# EAGLE design Intervalometer (EAGLE 5.02)
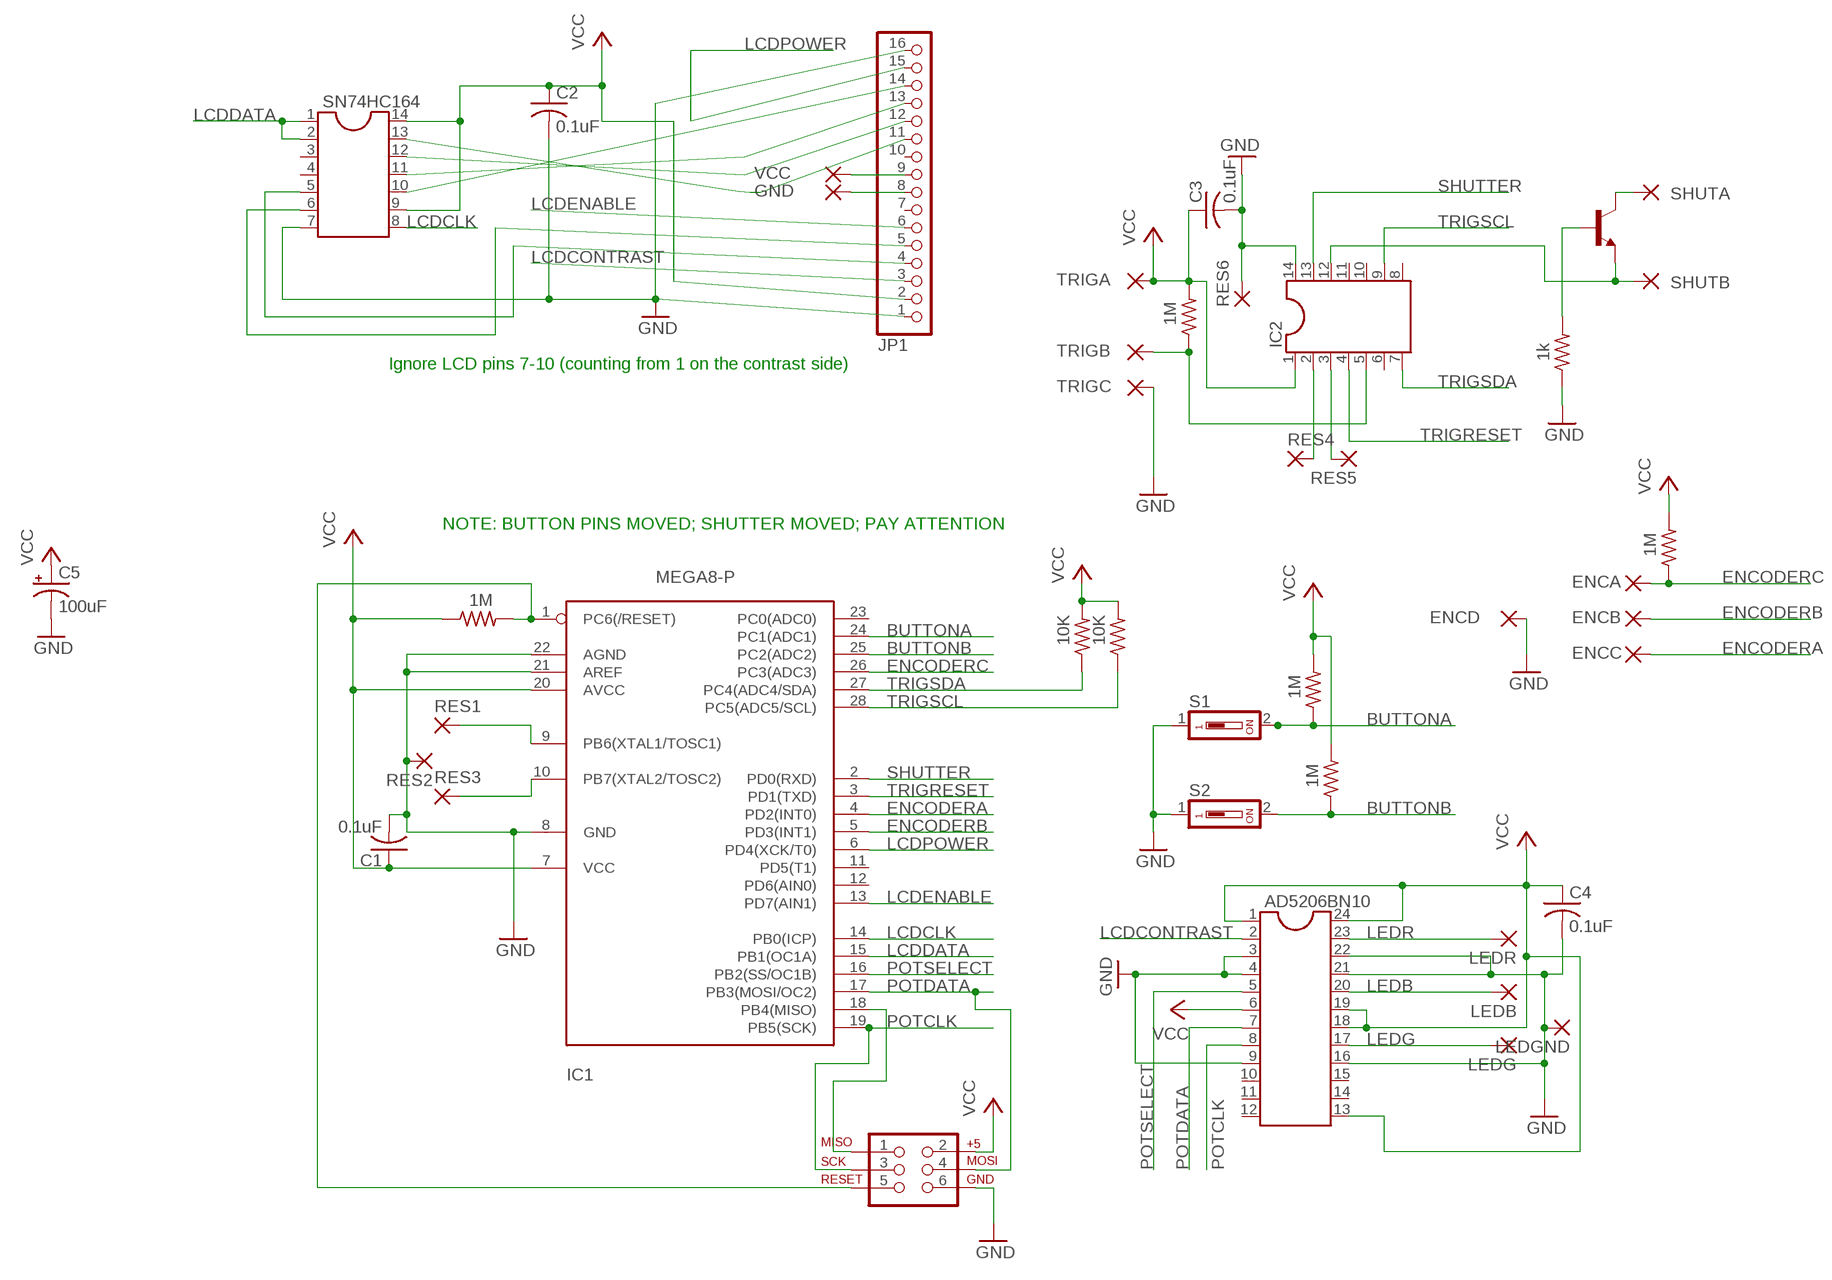
[diagram p0: schematic, sheet 1]

## Parts
AD5206BN10  DIL24-3  [DIL24-3]
C1  0.1uF  C-US025-025X050  [C025-025X050]
C2  0.1uF  C-US025-025X050  [C025-025X050]
C3  0.1uF  C-US025-025X050  [C025-025X050]
C4  0.1uF  C-US025-025X050  [C025-025X050]
C5  100uF  CPOL-USE2-5  [E2-5]
ENCA  1,6/0,9  [1,6/0,9]
ENCB  1,6/0,9  [1,6/0,9]
ENCC  1,6/0,9  [1,6/0,9]
ENCD  1,6/0,9  [1,6/0,9]
GND  1,6/0,9  [1,6/0,9]
IC1  MEGA8-P  [DIL28-3]
IC2  DIL14S  [SOCKET-14]
JP1  PINHD-1X16  [1X16]
LEDB  1,6/0,9  [1,6/0,9]
LEDG  1,6/0,9  [1,6/0,9]
LEDGND  1,6/0,9  [1,6/0,9]
LEDR  1,6/0,9  [1,6/0,9]
Q3  -NPN-TO92-EBC  [TO92-EBC]
R1  1M  R-US_0204/7  [0204/7]
R2  1k  R-US_0204/7  [0204/7]
R3  10K  R-US_0204/7  [0204/7]
R4  1M  R-US_0204/7  [0204/7]
R6  10K  R-US_0204/7  [0204/7]
R7  1M  R-US_0204/7  [0204/7]
R8  1M  R-US_0204/7  [0204/7]
R9  1M  R-US_0204/7  [0204/7]
RES1  1,6/0,9  [1,6/0,9]
RES2  1,6/0,9  [1,6/0,9]
RES3  1,6/0,9  [1,6/0,9]
RES4  1,6/0,9  [1,6/0,9]
RES5  1,6/0,9  [1,6/0,9]
RES6  1,6/0,9  [1,6/0,9]
S1  SD4-01  [SD4-01]
S2  SD4-01  [SD4-01]
SHUTA  1,6/0,9  [1,6/0,9]
SHUTB  1,6/0,9  [1,6/0,9]
SN74HC164  DIL14  [DIL14]
TRIGA  1,6/0,9  [1,6/0,9]
TRIGB  1,6/0,9  [1,6/0,9]
TRIGC  1,6/0,9  [1,6/0,9]
U$1  AVR_SPI_PRG_6PTH  [2X3]
VCC  1,6/0,9  [1,6/0,9]

## Nets
ASDF [adsf]: IC2.12 Q3.E SHUTB.1(P)
BUTTONA: IC1.24(PC1(ADC1)) R7.1 S1.2
BUTTONB: IC1.25(PC2(ADC2)) R8.1 S2.2
ENCODERA: ENCC.1(P) IC1.4(PD2(INT0))
ENCODERB: ENCB.1(P) IC1.5(PD3(INT1))
ENCODERC: ENCA.1(P) IC1.26(PC3(ADC3)) R4.1
GND [adsf]: AD5206BN10.3 AD5206BN10.4 AD5206BN10.9 AD5206BN10.16 AD5206BN10.21 AD5206BN10.22 C1.2 C2.2 C3.2 C4.2 C5.- ENCD.1(P) GND.1(P) IC1.8(GND) IC1.21(AREF) IC1.22(AGND) IC2.14 JP1.1 JP1.8 JP1.16 LEDGND.1(P) R2.1 RES2.1(P) RES6.1(P) S1.1 S2.1 SN74HC164.7 TRIGC.1(P) U$1.6
LCDCLK: IC1.14(PB0(ICP)) SN74HC164.8
LCDCONTRAST: AD5206BN10.2 JP1.3
LCDDATA: IC1.15(PB1(OC1A)) SN74HC164.1 SN74HC164.2
LCDENABLE: IC1.13(PD7(AIN1)) JP1.6
LCDPOWER: IC1.6(PD4(XCK/T0)) JP1.15
LEDB: AD5206BN10.20 LEDB.1(P)
LEDG: AD5206BN10.17 LEDG.1(P)
LEDR: AD5206BN10.23 LEDR.1(P)
N$1: IC1.9(PB6(XTAL1/TOSC1)) RES1.1(P)
N$2: IC1.10(PB7(XTAL2/TOSC2)) RES3.1(P)
N$3: IC1.1(PC6(/RESET)) R1.2 U$1.5
N$5: Q3.B R2.2
N$6 [adsf]: Q3.C SHUTA.1(P)
N$7: JP1.11 SN74HC164.13
N$8: JP1.12 SN74HC164.12
N$10: IC2.2 RES4.1(P)
N$11: IC2.5 R9.1 TRIGB.1(P)
N$12: JP1.4 SN74HC164.5
N$13: JP1.5 SN74HC164.6
N$14: IC2.3 RES5.1(P)
N$15: JP1.13 SN74HC164.11
N$16: JP1.14 SN74HC164.10
N$17: IC1.18(PB4(MISO)) U$1.1
POTCLK: AD5206BN10.8 IC1.19(PB5(SCK)) U$1.3
POTDATA: AD5206BN10.7 IC1.17(PB3(MOSI/OC2)) U$1.4
POTSELECT: AD5206BN10.5 IC1.16(PB2(SS/OC1B))
SHUTTER: IC1.2(PD0(RXD)) IC2.13
TRIGRESET: IC1.3(PD1(TXD)) IC2.4
TRIGSCL: IC1.28(PC5(ADC5/SCL)) IC2.9 R6.1
TRIGSDA: IC1.27(PC4(ADC4/SDA)) IC2.7 R3.1
VCC [adsf]: AD5206BN10.1 AD5206BN10.6 AD5206BN10.13 AD5206BN10.18 AD5206BN10.19 AD5206BN10.24 C1.1 C2.1 C3.1 C4.1 C5.+ IC1.7(VCC) IC1.20(AVCC) IC2.1 JP1.2 JP1.9 R1.1 R3.2 R4.2 R6.2 R7.2 R8.2 R9.2 SN74HC164.9 SN74HC164.14 TRIGA.1(P) U$1.2 VCC.1(P)
Unconnected: AD5206BN10.10 AD5206BN10.11 AD5206BN10.12 AD5206BN10.14 AD5206BN10.15 IC1.11(PD5(T1)) IC1.12(PD6(AIN0)) IC1.23(PC0(ADC0)) IC2.6 IC2.8 IC2.10 IC2.11 JP1.7 JP1.10 SN74HC164.3 SN74HC164.4

## Notes on the sheet
- Ignore LCD pins 7-10 (counting from 1 on the contrast side)
- NOTE: BUTTON PINS MOVED; SHUTTER MOVED; PAY ATTENTION

## Library data of the parts
AD5206BN10 = ic-package:DIL24: Dual In Line
C1-C4 = rcl:C-US: CAPACITOR, American symbol
C5 = rcl:CPOL-US: POLARIZED CAPACITOR, American symbol
ENCA ENCB ENCC ENCD GND LEDB LEDG LEDGND LEDR RES1-RES6 SHUTA SHUTB TRIGA TRIGB TRIGC VCC = wirepad:1,6/0,9: THROUGH-HOLE PAD
IC1 = atmel:MEGA8-P: MICROCONTROLLER 8 Kbytes FLASH, 1 kbytes SRAM, 512 bytes EEPROM, USART, 4-channel 10 bit ADC, 2-channel 8 bit ADC Pin compatible with Atmega48, ATMega88, ATMega168 Source: avr.lbr
IC2 SN74HC164 = ic-package:DIL14: Dual In Line / Socket
JP1 = pinhead:PINHD-1X16: PIN HEADER
Q3 = transistor-neu-to92:*-NPN-: NPN Transistror
R1-R4 R6-R9 = resistor:R-US_: RESISTOR, American symbol
S1 S2 = switch-dil:SD4-01: DIL/CODE SWITCH
U$1 = SparkFun:AVR_SPI_PRG_6: AVR ISP 6 Pin This is the reduced ISP connector for AVR programming. Common on Arduino. This footprint will take up less PCB space and can be used with a 10-pin to 6-pin adapter such as SKU: BOB-08508

## Net classes
1 adsf: width 0.61 mm

## Board
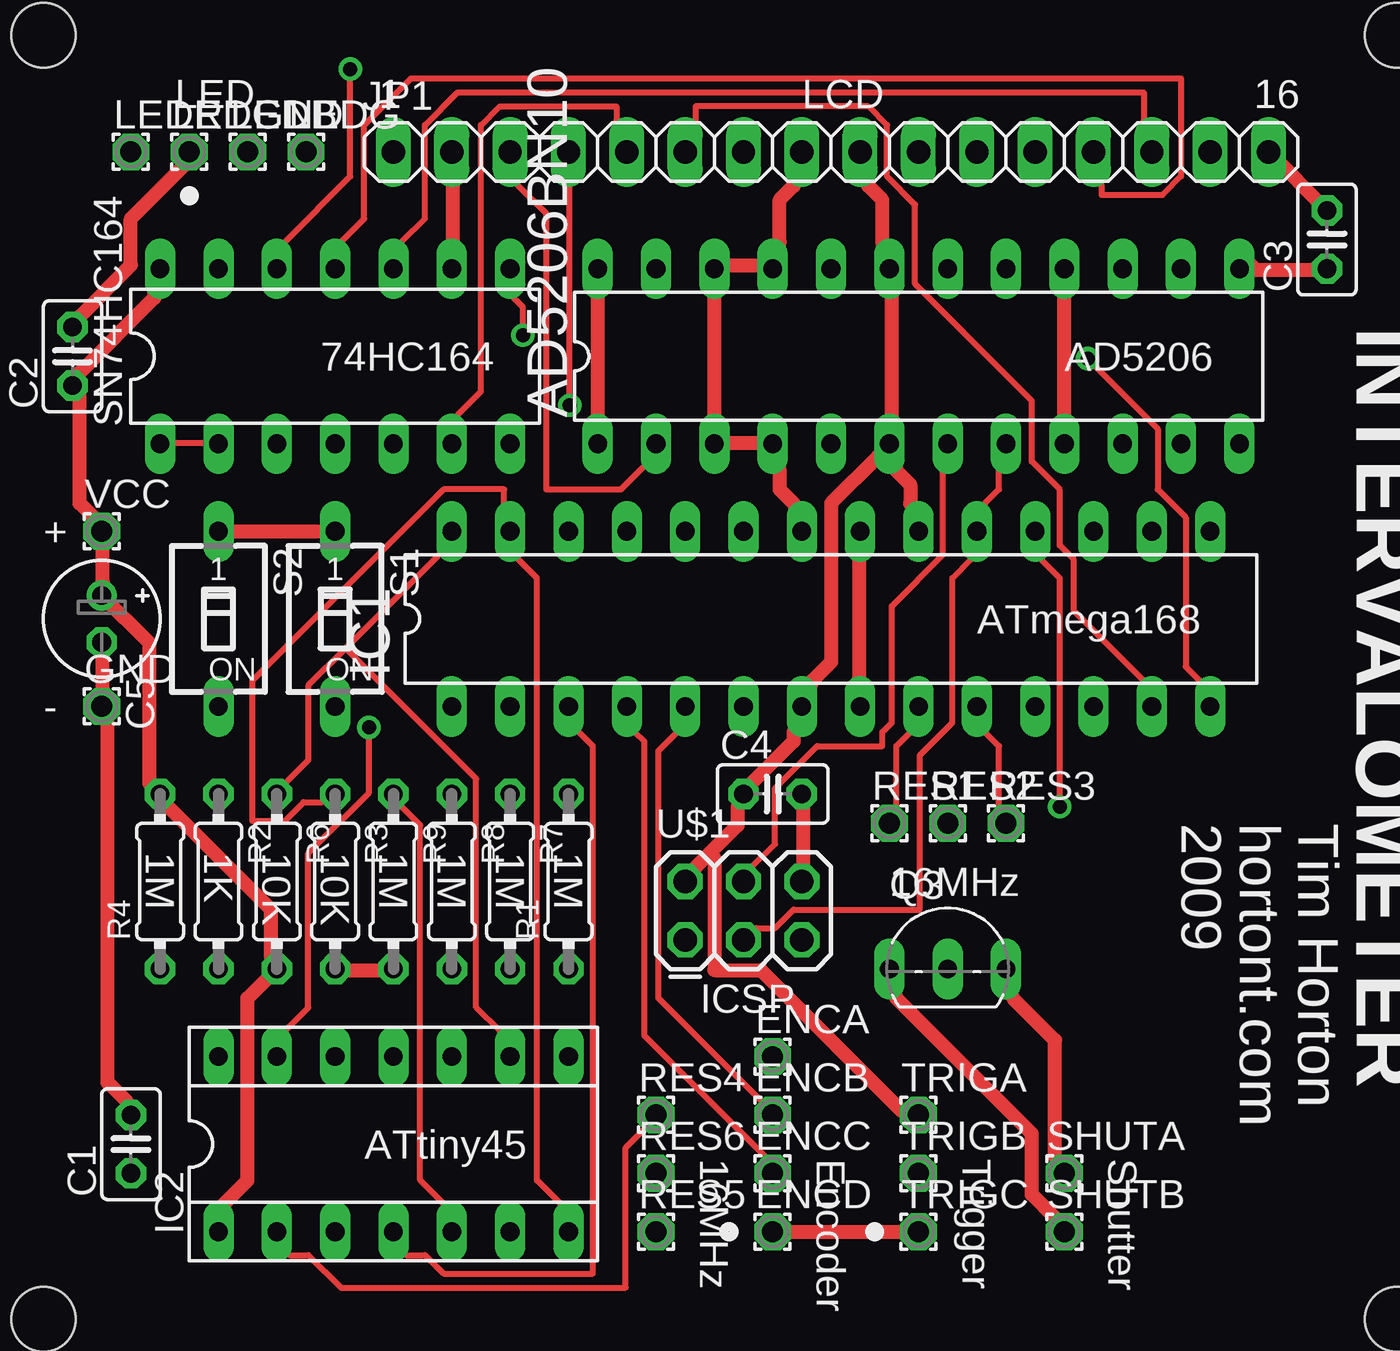
[diagram p1: board, top side]
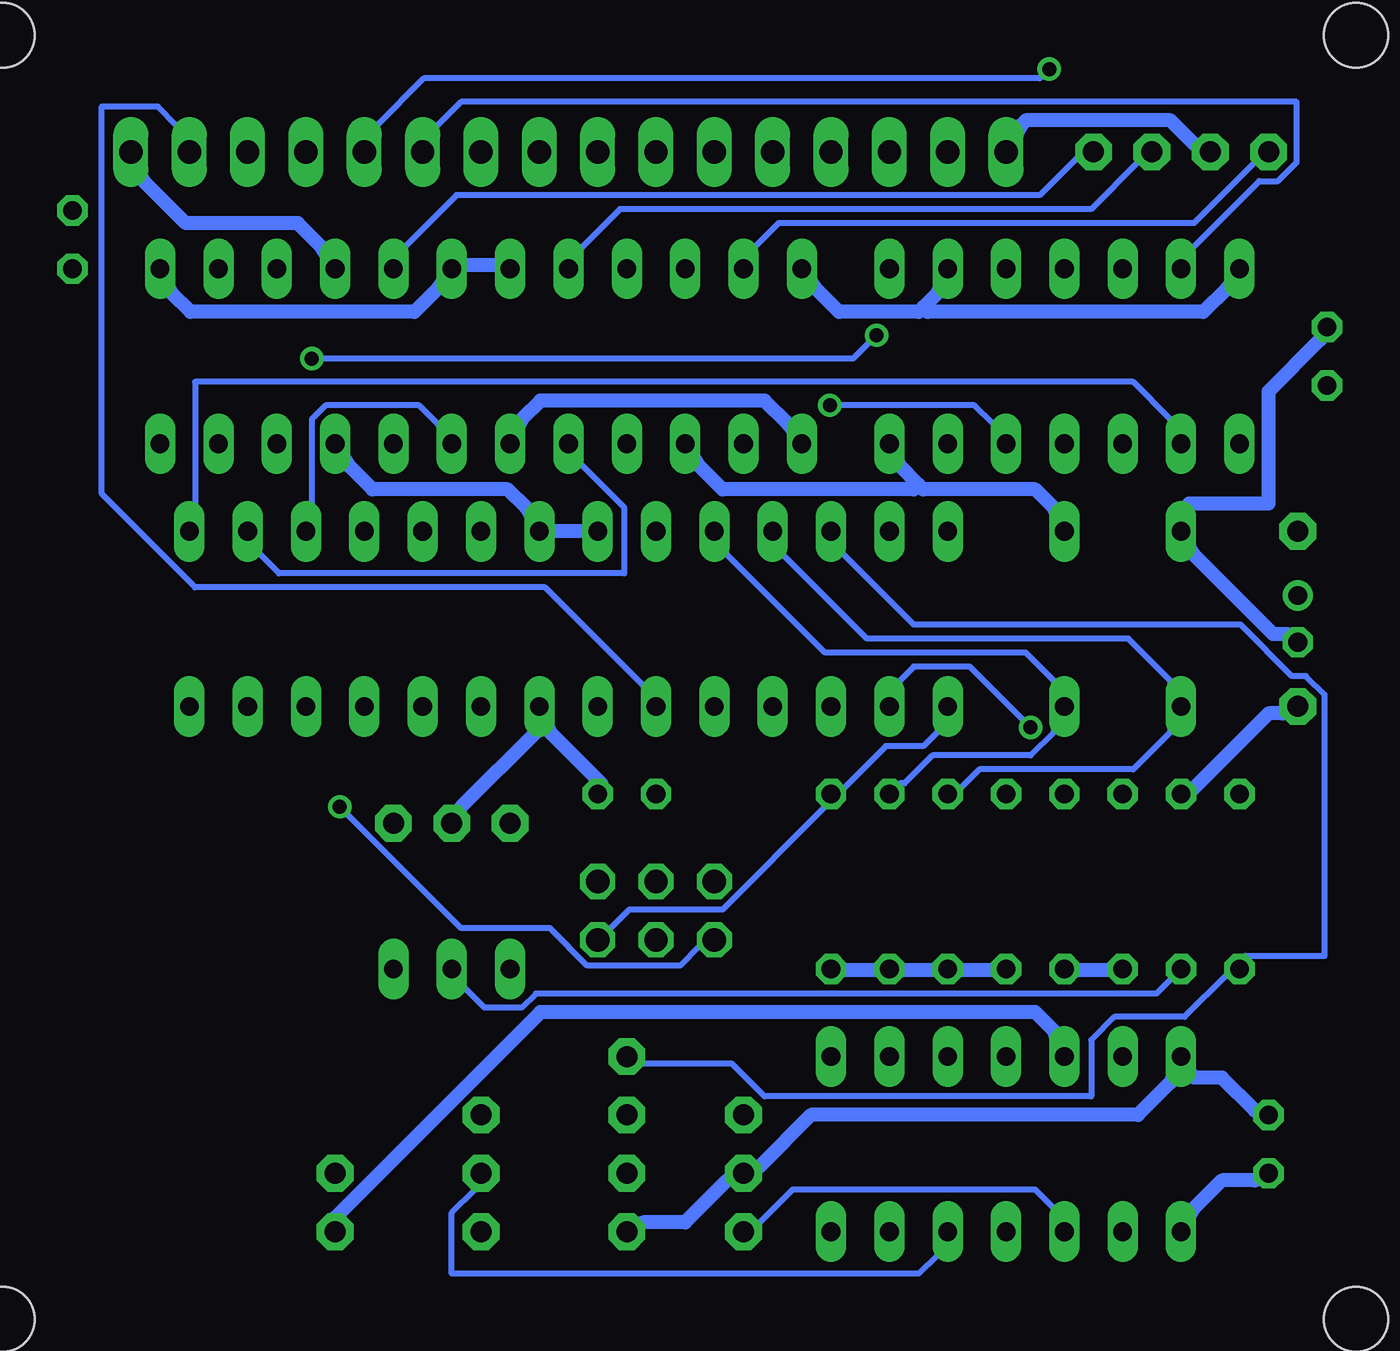
[diagram p2: board, bottom side, seen from below]

No outline drawn. Coordinates in mm, seen from the top.
Copper layers (1*16): Top 0.035mm / dielectric 1.5mm / Bottom 0.035mm
Design rules "default *": minimum track width 10mil, minimum drill 24mil, track to track 8mil, track to pad 8mil, pad to pad 8mil, via to via 8mil, smd to smd 8mil, copper to edge 40mil, drill to drill 8mil, minimum pad ring 10mil, minimum via ring 8mil, stop-mask expansion 4mil, vias tented up to drill 0mil, thermal gap 10mil
Holes 2.8 mm at 1.27,57.15 1.27,1.27 60.2,1.27 60.2,57.15

### Footprints (pad centres in the part's own frame; a part is rotated, then mirrored left to right if it is on the bottom)
DIL24-3 = drill 0.813 long: 1 -13.97,-3.81; 2 -11.43,-3.81; 3 -8.89,-3.81; 4 -6.35,-3.81; 5 -3.81,-3.81; 6 -1.27,-3.81; 7 1.27,-3.81; 8 3.81,-3.81; 9 6.35,-3.81; 10 8.89,-3.81; 11 11.43,-3.81; 12 13.97,-3.81; 13 13.97,3.81; 14 11.43,3.81; 15 8.89,3.81; 16 6.35,3.81; 17 3.81,3.81; 18 1.27,3.81; 19 -1.27,3.81; 20 -3.81,3.81; 21 -6.35,3.81; 22 -8.89,3.81; 23 -11.43,3.81; 24 -13.97,3.81
C025-025X050 = drill 0.813 octagon: 1 -1.27,0; 2 1.27,0
E2-5 = drill 0.813 pad 1.27 round: + -1.016,0 | drill 0.813 pad 1.27 octagon: - 1.016,0
1,6/0,9 = drill 0.914 pad 1.6 octagon: 1 0,0
DIL28-3 = drill 0.813 long: 1 -16.51,-3.81; 2 -13.97,-3.81; 3 -11.43,-3.81; 4 -8.89,-3.81; 5 -6.35,-3.81; 6 -3.81,-3.81; 7 -1.27,-3.81; 8 1.27,-3.81; 9 3.81,-3.81; 10 6.35,-3.81; 11 8.89,-3.81; 12 11.43,-3.81; 13 13.97,-3.81; 14 16.51,-3.81; 15 16.51,3.81; 16 13.97,3.81; 17 11.43,3.81; 18 8.89,3.81; 19 6.35,3.81; 20 3.81,3.81; 21 1.27,3.81; 22 -1.27,3.81; 23 -3.81,3.81; 24 -6.35,3.81; 25 -8.89,3.81; 26 -11.43,3.81; 27 -13.97,3.81; 28 -16.51,3.81
SOCKET-14 = drill 0.813 long: 1 -7.62,-3.81; 2 -5.08,-3.81; 3 -2.54,-3.81; 4 0,-3.81; 5 2.54,-3.81; 6 5.08,-3.81; 7 7.62,-3.81; 8 7.62,3.81; 9 5.08,3.81; 10 2.54,3.81; 11 0,3.81; 12 -2.54,3.81; 13 -5.08,3.81; 14 -7.62,3.81
1X16 = drill 1.016 long: 1 -19.05,0; 2 -16.51,0; 3 -13.97,0; 4 -11.43,0; 5 -8.89,0; 6 -6.35,0; 7 -3.81,0; 8 -1.27,0; 9 1.27,0; 10 3.81,0; 11 6.35,0; 12 8.89,0; 13 11.43,0; 14 13.97,0; 15 16.51,0; 16 19.05,0
TO92-EBC = drill 0.813 long: B 0,-1.27; C 2.54,-1.27; E -2.54,-1.27
0204/7 = drill 0.813 octagon: 1 -3.81,0; 2 3.81,0
SD4-01 = drill 0.813 long: 1 0,-3.81; 2 0,3.81
DIL14 = drill 0.813 long: 1 -7.62,-3.81; 2 -5.08,-3.81; 3 -2.54,-3.81; 4 0,-3.81; 5 2.54,-3.81; 6 5.08,-3.81; 7 7.62,-3.81; 8 7.62,3.81; 9 5.08,3.81; 10 2.54,3.81; 11 0,3.81; 12 -2.54,3.81; 13 -5.08,3.81; 14 -7.62,3.81
2X3 = drill 1.016 octagon: 1 0,0; 2 0,2.54; 3 2.54,0; 4 2.54,2.54; 5 5.08,0; 6 5.08,2.54

### Placement (x,y rotation side)
AD5206BN10  39.37,43.18 0 top
C1  5.08,8.89 90 top
C2  2.54,43.18 90 top
C3  57.15,48.26 90 top
C4  33.02,24.13 0 top
C5  3.81,31.75 270 top
ENCA  33.02,12.7 0 top
ENCB  33.02,10.16 0 top
ENCC  33.02,7.62 0 top
ENCD  33.02,5.08 0 top
GND  3.81,27.94 0 top
IC1  35.56,31.75 0 top
IC2  16.51,8.89 0 top
JP1  35.56,52.07 0 top
LEDB  10.16,52.07 0 top
LEDG  12.7,52.07 0 top
LEDGND  7.62,52.07 0 top
LEDR  5.08,52.07 0 top
Q3  40.64,17.78 0 top
R1  24.13,20.32 90 top
R2  8.89,20.32 270 top
R3  13.97,20.32 270 top
R4  6.35,20.32 90 top
R6  11.43,20.32 270 top
R7  21.59,20.32 270 top
R8  19.05,20.32 270 top
R9  16.51,20.32 270 top
RES1  38.1,22.86 0 top
RES2  40.64,22.86 0 top
RES3  43.18,22.86 0 top
RES4  27.94,10.16 0 top
RES5  27.94,5.08 0 top
RES6  27.94,7.62 0 top
S1  13.97,31.75 180 top
S2  8.89,31.75 180 top
SHUTA  45.72,7.62 0 top
SHUTB  45.72,5.08 0 top
SN74HC164  13.97,43.18 0 top
TRIGA  39.37,10.16 0 top
TRIGB  39.37,7.62 0 top
TRIGC  39.37,5.08 0 top
U$1  29.21,17.78 0 top
VCC  3.81,35.56 0 top

### Tracks (layer width: path | path; a pad name or v marks a point on that pad's centre or on a via)
ASDF
  Top 0.61: Q3.E 38.41,15.24 44.3,9.35 44.3,6.71 45.31,5.69 SHUTB.1
  Bottom 0.61: IC2.12 14.43,13.82 15.24,14.63 36.78,14.63 45.72,5.69 SHUTB.1
BUTTONA
  Bottom 0.254: R7.1 21.13,24.59 20.93,24.59 19.71,25.81 15.44,25.81 14.43,26.82 S1.2 14.43,29.06 15.65,30.28 24.38,30.28 28.65,34.54 IC1.24
BUTTONB
  Bottom 0.254: R8.1 18.49,24.38 17.68,25.2 10.97,25.2 9.35,26.82 S2.2 9.35,29.06 11.18,30.89 22.55,30.89 26.21,34.54 IC1.25
ENCODERA
  Top 0.254: IC1.4 27.03,26.82 27.43,26.42 27.43,13.61 32.72,8.33 ENCC.1
ENCODERB
  Top 0.254: IC1.5 28.85,26.82 28.04,26.01 28.04,15.24 32.51,10.77 ENCB.1
ENCODERC
  Bottom 0.254: ENCA.1 32.31,12.39 28.45,12.39 27.03,10.97 12.8,10.97 12.8,13.41 11.79,14.43 8.74,14.43 6.91,16.26 R4.1 6.1,17.07 2.64,17.07 2.64,28.45 3.45,29.26 4.06,29.26 6.3,31.5 20.52,31.5 23.57,34.54 IC1.26
GND
  Top 0.61: C4.2 34.34,23.57 34.34,20.93 U$1.6 | JP1.8 33.93,50.6 33.33,49.99 33.33,48.16 AD5206BN10.21 32.51,47.14 31.09,47.14 AD5206BN10.22 AD5206BN10.3 31.09,39.42 32.51,39.42 AD5206BN10.4 33.33,38.2 33.33,37.39 33.93,36.78 IC1.22 | AD5206BN10.9 AD5206BN10.16 | IC1.8 36.78,29.06 36.78,34.34 IC1.21 | C2.2 2.85,44.91 5.08,47.14 5.08,49.17 7.32,51.41 LEDGND.1 | S2.1 S1.1 | ENCD.1 TRIGC.1 | C5.- 3.86,30.28 3.86,28.65 GND.1 4.06,27.23 4.06,11.58 4.88,10.77 C1.2 | JP1.16 C3.2
  Bottom 0.61: C4.2 34.14,24.59 36.37,26.82 IC1.8 36.98,26.82 40.23,23.57 RES2.1 | IC1.22 IC1.21 37.39,36.58 38.2,37.39 44.09,37.39 45.11,38.41 AD5206BN10.9 | JP1.1 15.85,53.24 15.65,53.44 9.35,53.44 8.33,52.43 LEDGND.1 | 20.32,37.59 20.12,37.39 15.24,37.39 14.43,36.58 S1.1 | 20.32,37.59 21.13,38.41 SN74HC164.7 | ENCD.1 32.31,5.49 30.48,5.49 28.65,7.32 RES6.1 27.23,7.92 24.99,10.16 10.77,10.16 9.35,11.58 IC2.14 8.33,11.79 7.11,11.79 5.69,10.36 C1.2 | R2.1 8.33,24.38 5.08,27.64 4.47,27.64 GND.1 | C5.- 4.27,31.09 4.88,31.09 8.33,34.54 S2.1 8.53,36.78 5.08,36.78 5.08,41.66 2.85,43.89 C2.2 | AD5206BN10.3 29.87,38.41 28.85,37.39 20.52,37.39 20.32,37.59 | JP1.16 54.05,50.8 52.22,48.97 47.35,48.97 46.33,47.95 AD5206BN10.16
LCDCLK  (via drill 0.61)
  Top 0.254: v22.15,44.09 22.15,45.31 21.74,45.72 SN74HC164.8 | v46.74,43.08 49.78,40.03 49.78,37.39 51,36.17 51,29.67 51.61,29.06 IC1.14
  Bottom 0.254: v22.15,44.09 23.16,43.08 v46.74,43.08
LCDCONTRAST
  Top 0.254: AD5206BN10.2 27.43,38.41 26.42,37.39 23.16,37.39 23.16,49.38 21.95,50.6 JP1.3
LCDDATA
  Top 0.254: SN74HC164.1 6.91,39.42 8.33,39.42 SN74HC164.2
  Bottom 0.254: IC1.15 51.82,36.78 51.82,42.06 10.97,42.06 9.35,40.44 SN74HC164.2
LCDENABLE
  Top 0.254: IC1.13 49.17,29.06 46.13,32.11 46.13,34.34 45.52,34.95 45.52,37.39 44.3,38.61 44.3,41.25 39.22,46.33 39.22,49.78 38,51 38,53.24 37.19,54.05 29.67,54.05 29.67,53.44 JP1.6
LCDPOWER
  Bottom 0.254: IC1.6 32.31,28.85 36.58,33.12 51.82,33.12 55.88,37.19 55.88,54.05 53.44,54.05 52.63,53.24 JP1.15
LEDB
  Bottom 0.254: AD5206BN10.20 34.95,47.95 33.33,49.58 12.8,49.58 10.77,51.61 LEDB.1
LEDG
  Bottom 0.254: AD5206BN10.17 42.67,47.95 40.44,50.19 15.04,50.19 13.41,51.82 LEDG.1
LEDR
  Bottom 0.254: AD5206BN10.23 27.43,47.95 26.42,48.97 8.33,48.97 5.69,51.61 LEDR.1
N$1
  Top 0.254: IC1.9 39.01,26.82 38.41,26.21 38.41,23.57 RES1.1
N$2
  Top 0.254: IC1.10 42.27,26.82 42.88,26.21 42.88,23.57 RES3.1
N$3
  Bottom 0.254: IC1.1 19.51,26.82 20.12,26.21 21.74,26.21 23.57,24.38 R1.2 24.38,23.57 28.85,19.1 32.92,19.1 33.73,18.29 U$1.5
N$5
  Bottom 0.254: R2.2 9.96,15.44 36.98,15.44 37.59,14.83 39.22,14.83 40.03,15.65 Q3.B
N$6
  Top 0.61: Q3.C 43.48,15.24 45.31,13.41 45.31,8.33 SHUTA.1
N$7
  Bottom 0.254: SN74HC164.13 8.33,47.95 5.49,50.8 4.67,50.8 3.86,51.61 3.86,54.25 40.23,54.25 41.25,53.24 JP1.11
N$8  (via drill 0.61)
  Top 0.254: v14.63,55.68 14.63,51 11.79,48.16 SN74HC164.12
  Bottom 0.254: v14.63,55.68 15.04,55.27 41.86,55.27 43.89,53.24 JP1.12
N$10
  Top 0.254: IC2.2 11.99,4.06 12.8,4.06 14.22,2.64 26.62,2.64 26.62,8.74 27.43,9.55 RES4.1
N$11
  Top 0.254: IC2.5 18.69,6.3 17.68,7.32 17.68,22.76 16.87,23.57 R9.1
  Bottom 0.254: TRIGB.1 39.62,6.91 40.64,5.89 40.64,3.25 20.32,3.25 19.51,4.06 IC2.5
N$12  (via drill 0.61)
  Top 0.254: v24.18,41.05 24.18,50.6 JP1.4
  Bottom 0.254: v24.18,41.05 17.88,41.05 17.07,40.23 SN74HC164.5
N$13
  Top 0.254: SN74HC164.6 19.3,40.64 20.32,41.66 20.32,53.24 21.13,54.05 26.21,54.05 26.21,53.44 JP1.5
N$14
  Bottom 0.254: IC2.3 14.43,6.1 15.24,6.91 25.81,6.91 27.23,5.49 RES5.1
N$15
  Top 0.254: SN74HC164.11 14.22,48.16 15.24,49.17 15.24,53.24 17.27,55.27 50.8,55.27 50.8,51 49.99,50.19 47.35,50.19 47.35,50.6 JP1.13
N$16
  Top 0.254: SN74HC164.10 16.87,48.16 17.88,49.17 17.88,53.24 19.3,54.66 49.17,54.66 49.17,53.44 JP1.14
N$17  (via drill 0.61)
  Top 0.254: v45.52,23.57 45.52,33.53 44.7,34.34 IC1.18
  Bottom 0.254: v45.52,23.57 40.23,18.29 36.37,18.29 34.75,16.66 30.68,16.66 29.87,17.48 U$1.1
POTCLK
  Top 0.254: AD5206BN10.8 42.88,38.2 42.88,37.39 42.27,36.78 IC1.19 41.66,34.34 40.84,33.53 40.84,27.23 39.42,25.81 39.42,19.1 33.93,19.1 33.12,18.29 32.31,18.29 U$1.3
POTDATA
  Top 0.254: U$1.4 32.11,20.93 33.12,21.95 33.12,24.38 34.95,26.21 37.8,26.21 37.8,26.82 38.2,27.23 38.2,32.31 40.44,34.54 40.44,38.2 AD5206BN10.7
  Bottom 0.254: AD5206BN10.7 41.25,40.23 42.06,41.05 46.13,41.05 46.74,40.44 46.74,36.78 IC1.17
POTSELECT
  Bottom 0.254: AD5206BN10.5 34.95,38.41 33.12,36.58 33.12,33.73 48.16,33.73 48.97,34.54 IC1.16
SHUTTER  (via drill 0.61)
  Top 0.254: v15.44,27.03 15.44,24.18 12.8,21.54 12.8,14.83 11.79,13.82 IC2.13
  Bottom 0.254: v15.44,27.03 18.09,29.67 20.52,29.67 21.13,29.06 IC1.2
TRIGRESET
  Top 0.254: IC2.4 17.07,4.06 17.88,4.06 18.69,3.25 25.2,3.25 25.2,26.21 24.59,26.82 IC1.3
TRIGSCL
  Top 0.254: 14.43,30.48 18.49,34.54 IC1.28 | 14.43,30.48 12.8,28.85 12.8,25.6 11.79,24.59 R6.1 | 14.43,30.48 20.12,24.79 20.12,14.83 21.13,13.82 IC2.9
TRIGSDA
  Top 0.254: IC2.7 23.77,6.3 22.76,7.32 22.76,33.53 21.95,34.34 IC1.27 21.34,36.78 21.34,37.39 18.69,37.39 10.36,29.06 10.36,22.96 11.79,22.96 12.6,23.77 13.41,23.77 R3.1
VCC
  Top 0.61: SN74HC164.14 6.1,45.72 2.85,42.47 C2.1 2.85,41.45 2.85,36.78 3.45,36.17 VCC.1 3.86,34.95 3.86,33.33 C5.+ 5.89,30.68 5.89,24.59 R4.2 6.71,23.57 11.18,19.1 11.18,17.07 R6.2 10.16,15.24 10.16,7.32 9.14,6.3 IC2.1 | 30.28,21.54 31.5,22.76 31.5,23.57 C4.1 32.11,24.59 33.93,26.42 33.93,26.82 IC1.7 34.75,29.06 35.56,29.87 35.56,36.78 37.59,38.81 AD5206BN10.6 | 30.28,21.54 29.67,20.93 U$1.2 | TRIGA.1 38.61,10.36 32.51,16.46 30.48,16.46 30.48,21.34 30.28,21.54 | SN74HC164.9 19.1,48.16 19.1,50.6 JP1.2 | AD5206BN10.24 AD5206BN10.1 | AD5206BN10.6 38.41,38.2 39.01,37.59 39.01,36.78 IC1.20 | AD5206BN10.13 53.85,47.14 54.05,46.94 56.69,46.94 C3.1 | JP1.9 37.19,50.6 37.8,49.99 37.8,48.16 AD5206BN10.19 38.2,45.72 38.2,40.64 AD5206BN10.6 | R9.2 16.05,16.46 14.43,16.46 R3.2
  Bottom 0.61: IC2.1 8.33,6.1 7.11,7.32 5.69,7.32 C1.1 | R1.1 23.57,16.46 22.15,16.46 R7.2 21.13,16.46 19.51,16.46 R8.2 18.49,16.46 17.07,16.46 R9.2 | R6.2 11.99,16.46 13.41,16.46 R3.2 | 20.12,45.31 20.32,45.11 23.77,45.11 24.79,46.13 AD5206BN10.24 | 20.12,45.31 19.51,45.92 SN74HC164.9 | AD5206BN10.19 38.61,47.14 40.03,47.14 AD5206BN10.18 41.25,46.13 42.27,45.11 52.02,45.11 52.83,45.92 AD5206BN10.13 | AD5206BN10.1 26.01,40.23 27.03,41.25 36.78,41.25 37.59,40.44 AD5206BN10.6 | SN74HC164.14 6.91,46.13 7.92,45.11 19.91,45.11 20.12,45.31

### Text on the board
tPlace: LED | 1 | LCD | 16 | INTERVALOMETER | 74HC164 | AD5206 | + | ATmega168 | - | 2009 | hortont.com | Tim Horton | 1M | 1K | 10K | 10K | 1M | 1M | 1M | 1M | 16MHz | ICSP | ATtiny45 | 16MHz | Encoder | Trigger | Shutter